# Altium schematic sheet Bluetooth.SchDoc
size A4
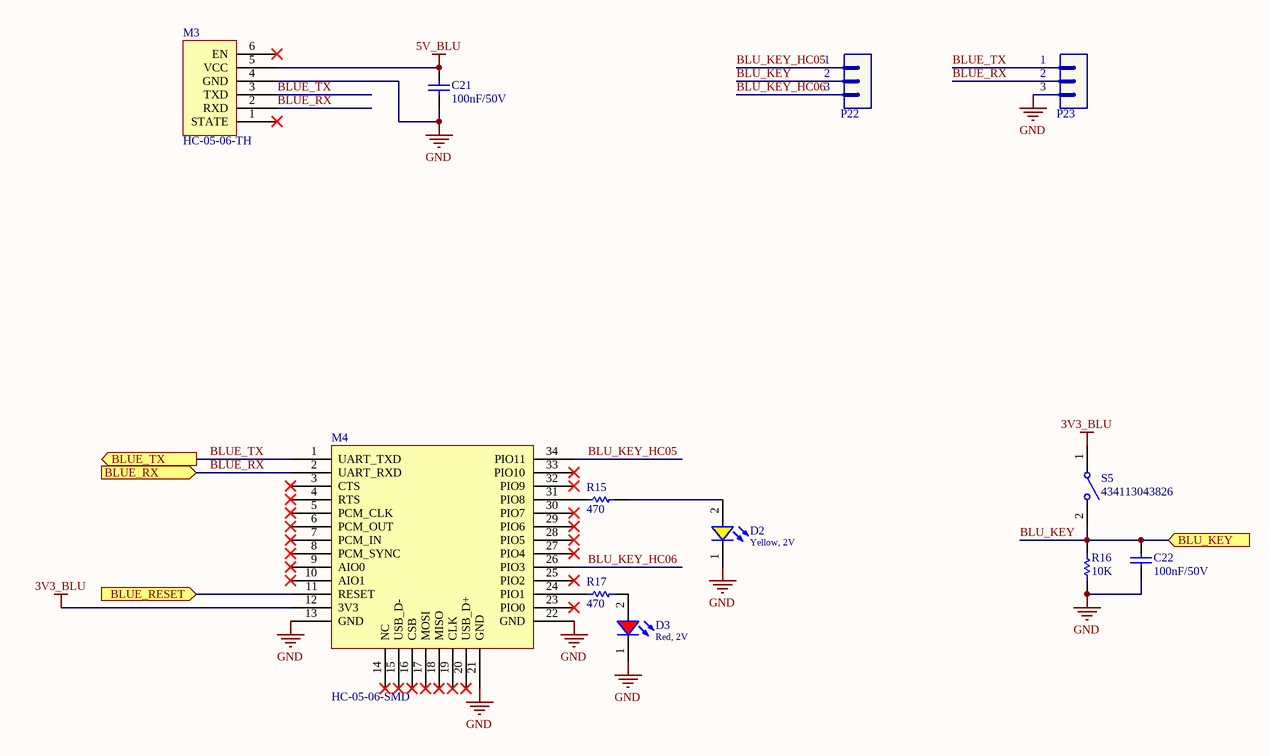
[diagram p0: Bluetooth.SchDoc]

## Parts
C21  value 100nF/50V  [CAP-SM-0805]  (hidden comment: Cap-100nF-50V-0805)
C22  value 100nF/50V  [CAP-SM-0805]  (hidden comment: Cap-100nF-50V-0805)
D2  Yellow, 2V  [WL-SMCW_0805]
D3  Red, 2V  [WL-SMCW_0805]
M3  HC-05-06-TH  [HC-05-06-TH]
M4  HC-05-06-SMD  [HC-05-06-SMD]
P22  Header 3  [JP3]  (value not drawn)
P23  Header 3  [JP3]  (value not drawn)
R15  value 470  [RES-SM-0805]  (hidden comment: Res-470-0805)
R16  value 10K  [RES-SM-0805]  (hidden comment: Res-10k-0805)
R17  value 470  [RES-SM-0805]  (hidden comment: Res-470-0805)
S5  434113043826  [434113043826]

## Ports
BLU_KEY (in), BLUE_RESET (in), BLUE_RX (in), BLUE_TX (out)

## Nets
3V3_BLU: M4.12(3V3) S5.1
5V_BLU: C21.2 M3.5(VCC)
GND: C21.1 C22.1 D2.1(K) D3.1(K) M3.4(GND) M4.13(GND) M4.21(GND) M4.22(GND) P23.3 R16.1
BLU_KEY: C22.2 P22.2 R16.2 S5.2 ; port BLU_KEY
BLU_KEY_HC05: M4.34(PIO11) P22.1
BLU_KEY_HC06: M4.26(PIO3) P22.3
BLUE_RESET: M4.11(RESET) ; port BLUE_RESET
BLUE_RX: M3.2(RXD) M4.2(UART_RXD) P23.2 ; port BLUE_RX
BLUE_TX: M3.3(TXD) M4.1(UART_TXD) P23.1 ; port BLUE_TX
NetD2_2: D2.2(A) R15.2
NetD3_2: D3.2(A) R17.2
NetM4_24: M4.24(PIO1) R17.1
NetM4_31: M4.31(PIO8) R15.1

Not connected (* = marked no-connect by the designer): M3 1(STATE)* 6(EN)*; M4 3(CTS)* 4(RTS)* 5(PCM_CLK)* 6(PCM_OUT)* 7(PCM_IN)* 8(PCM_SYNC)* 9(AIO0)* 10(AIO1)* 14(NC)* 15(USB_D-)* 16(CSB)* 17(MOSI)* 18(MISO)* 19(CLK)* 20(USB_D+)* 23(PIO0)* 25(PIO2)* 27(PIO4)* 28(PIO5)* 29(PIO6)* 30(PIO7)* 32(PIO9)* 33(PIO10)*

## Notes on the sheet
- Date:
- Project:
- Number:
- 0916710807
- Self_Balancing_Robot
- Sheet
- Author:
- of
- Revision:
- 1.1
- Thanhzil&CuongCb
- Pay It Forward Club - HCMUT
- File:
- Bluetooth.schdoc

## Library data of the parts
C21 C22 = Cap-100nF-50V-0805: CAP CER 0.1UF 50V Y5V 0805; Manufacturer: Samsung Electro-Mechanics; Manufacturer Part Number: CL21F104ZBCNNNC; Local Supplier: thegioiic; Local Supplier Link: https://thegioiic.com/products/tu-100nf-0-1uf-50v-0805; Supplier 1: Digikey; Supplier 1 Part Number: 1276-1007-1-ND; Supplier 1 Link: https://www.digikey.com/product-detail/en/samsung-electro-mechanics/CL21F104ZBCNNNC/1276-1007-1-ND/3889093
D2 = 150080YS75000: WL-SMCW SMT Mono-color Chip LED Waterclear, size 0805, Yellow, 2V, 140deg; Chip Technology: AlInGaP; Dominant Wavelength typ.: 590nm; Luminous Intensity typ.: 120mcd; Peak Wavelength typ.: 595nm; Viewing Angle: 140deg; ComponentLink1Description: Manufacturer; ComponentLink1URL: http://www.we-online.de; ComponentLink2URL: https://www.we-online.com/catalog/datasheet/150080YS75000.pdf; ComponentLink2Description: Datasheet; Forward Voltage typ.: 2V; Emitting Color: Yellow; Mounting Technology: SMT; Operating Temperature: -40 to +85degC; Published Date: December 2019; Part Number: 150080YS75000; Packaging: Tape and Reel; Size: 0805; Publisher: Wurth Elektronik
D3 = 150080RS75000: WL-SMCW SMT Mono-color Chip LED Waterclear, size 0805, Red, 2V, 140deg; Chip Technology: AlInGaP; Dominant Wavelength typ.: 625nm; Luminous Intensity typ.: 150mcd; Peak Wavelength typ.: 630nm; Viewing Angle: 140deg; ComponentLink1Description: Manufacturer; ComponentLink1URL: http://www.we-online.de; ComponentLink2URL: https://www.we-online.com/catalog/datasheet/150080RS75000.pdf; ComponentLink2Description: Datasheet; Forward Voltage typ.: 2V; Emitting Color: Red; Mounting Technology: SMT; Operating Temperature: -40 to +85degC; Published Date: December 2019; Part Number: 150080RS75000; Packaging: Tape and Reel; Size: 0805; Publisher: Wurth Elektronik
P22 P23 = Header 3: Header, 3-Pin; LatestRevisionDate: 17-Jul-2002; LatestRevisionNote: Re-released for DXP Platform.; Publisher: Altium Limited
R15 R17 = Res-470-0805: RES 470 OHM JUMPER 0805; Manufacturer: YAG6006CT-ND; Manufacturer Part Number: PE0805FRF7W0R047L; Local Supplier: thegioiic; Local Supplier Link: https://www.thegioiic.com/products/dien-tro-470-kohm-0805-5; Supplier 1: Digikey; Supplier 1 Link: https://www.digikey.com/product-detail/en/yageo/PE0805FRF7W0R047L/YAG6006CT-ND/9696460; Supplier 1 Part Number: YAG6006CT-ND
R16 = Res-10k-0805: RES 10K OHM 1% 1/4W 0805; Manufacturer: Stackpole Electronics Inc; Manufacturer Part Number: RNCP0805FTD10K0; Local Supplier: thegioiic; Local Supplier Link: https://thegioiic.com/products/dien-tro-10k-ohm-0805-5; Supplier 1: Digikey; Supplier 1 Link: https://www.digikey.com/product-detail/en/stackpole-electronics-inc/RNCP0805FTD10K0/RNCP0805FTD10K0CT-ND/2240601; Supplier 1 Part Number: RNCP0805FTD10K0CT-ND
S5 = 434113043826: WS-TASV J-Bend SMT Tact Switch 6x3.5mm, height 4.3mm, 260gf; Rated Voltage: 12VDC; Rated Current: 50mA; Washable: No; ComponentLink1Description: Manufacturer; ComponentLink1URL: http://www.we-online.de; ComponentLink2Description: Datasheet; ComponentLink2URL: https://katalog.we-online.com/em/datasheet/434113043826.pdf; Operating Temperature: -40 to +85degC; Part Number: 434113043826; Published Date: September 2019; Contact Material: Stainless Steel; Height: 4.3mm; Mounting Technology: SMT; Contact Plating: Silver; Operation Force: 260gf; Packaging: Tape and Reel; Terminal Material: Copper Alloy; Publisher: Wurth Elektronik; Terminal Plating: Silver
M3 = HC-05-06-TH: Local Supplier Link: https://hshop.vn/products/mach-thu-phat-bluetooth-hc-05-do-ra-chon-master; Local Supplier Part Number: HS000882; Manufacturer: *; Manufacturer Part Number: *; Local Supplier: HShop
M4 = HC-05-06-SMD: Local Supplier Link: https://hshop.vn/products/mach-thu-phat-bluetooth-hc-05-chua-ra-chon-master; Local Supplier Part Number: HS000881; Manufacturer: *; Manufacturer Part Number: *; Local Supplier: HShop